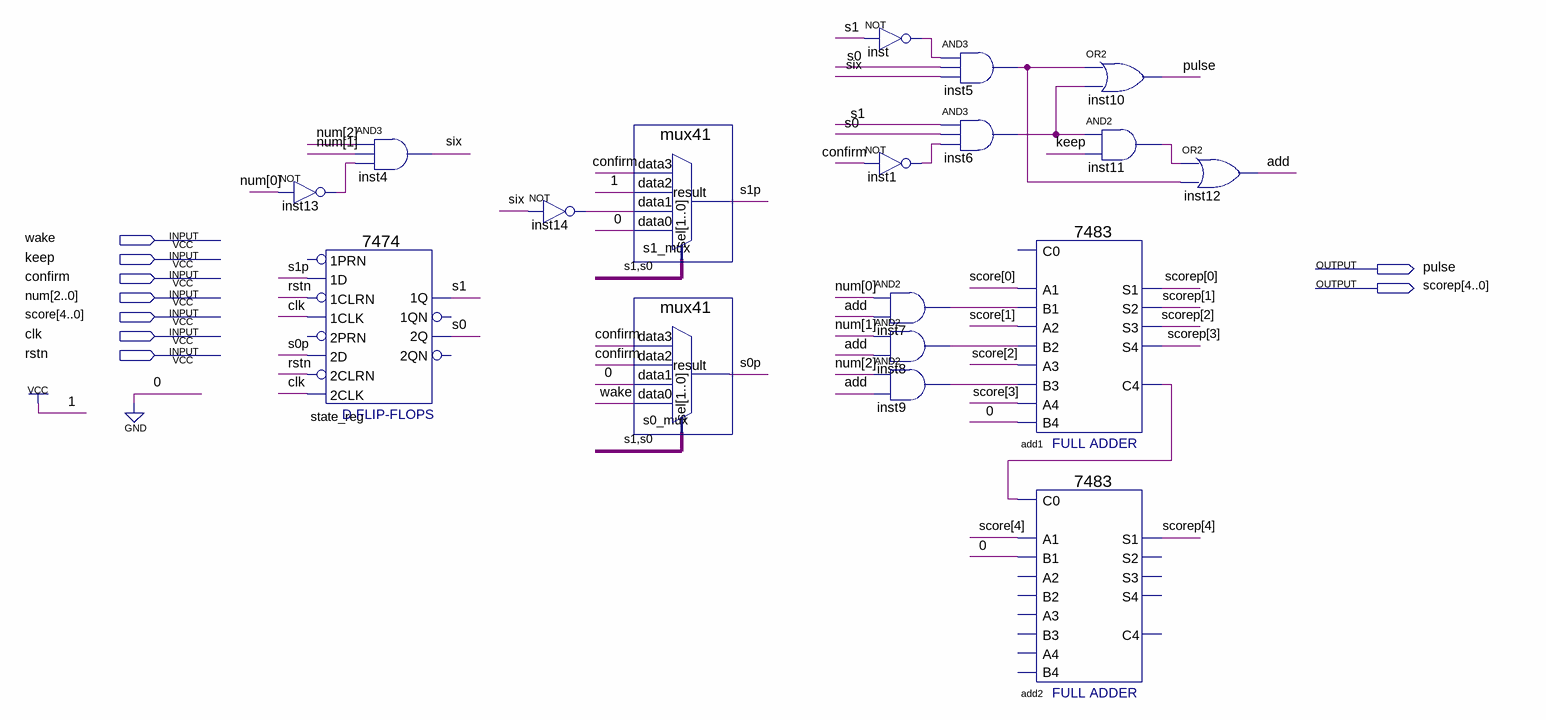
[diagram p0: schematic sheet]
// Quartus schematic Choose.bdf as structural Verilog: 18 symbols, 9 pins
module Choose (
  input  wake,
  input  keep,
  input  confirm,
  input  [2:0] num,
  input  [4:0] score,
  input  clk,
  input  rstn,
  output pulse,
  output [4:0] scorep
);

  wire add, add1_c4, inst1_out, inst5_out, inst6_out, inst7_out, inst8_out, inst9_out, inst11_out,
       inst13_out, inst14_out, inst_out, s0, s0p, s1, s1p, six;

  not inst13 (inst13_out, num[0]);
  and inst4 (six, num[2], num[1], inst13_out);
  \7474  state_reg (
    .\2D (s0p), .\1CLK (clk), .\1D (s1p), .\2CLK (clk), .\2CLRN (rstn), .\1CLRN (rstn), .\2Q (s0), .\1Q (s1));  // open: 2PRN, 1PRN, 1QN, 2QN
  not inst14 (inst14_out, six);
  mux41 s1_mux (.data3(confirm), .data2(1'b1), .data1(inst14_out), .data0(1'b0), .sel({s1, s0}), .result(s1p));
  mux41 s0_mux (.data3(confirm), .data2(confirm), .data1(1'b0), .data0(wake), .sel({s1, s0}), .result(s0p));
  not inst (inst_out, s1);
  not inst1 (inst1_out, confirm);
  and inst7 (inst7_out, num[0], add);
  and inst8 (inst8_out, num[1], add);
  and inst9 (inst9_out, num[2], add);
  and inst5 (inst5_out, inst_out, s0, six);
  and inst6 (inst6_out, s1, s0, inst1_out);
  \7483  add1 (
    .B4(1'b0), .A1(score[0]), .A2(score[1]), .B1(inst7_out), .B2(inst8_out), .A3(score[2]), .B3(inst9_out),
    .A4(score[3]), .S3(scorep[2]), .S4(scorep[3]), .S2(scorep[1]), .C4(add1_c4), .S1(scorep[0]));  // open: C0
  \7483  add2 (.C0(add1_c4), .A1(score[4]), .B1(1'b0), .S1(scorep[4]));  // open: B4, A2, B2, A3, B3, A4, S3, S4, S2, C4
  or inst10 (pulse, inst5_out, inst6_out);
  and inst11 (inst11_out, inst6_out, keep);
  or inst12 (add, inst11_out, inst5_out);
endmodule
